# EAGLE schematic Amp_Test_7.2.4 (EAGLE 6.4)
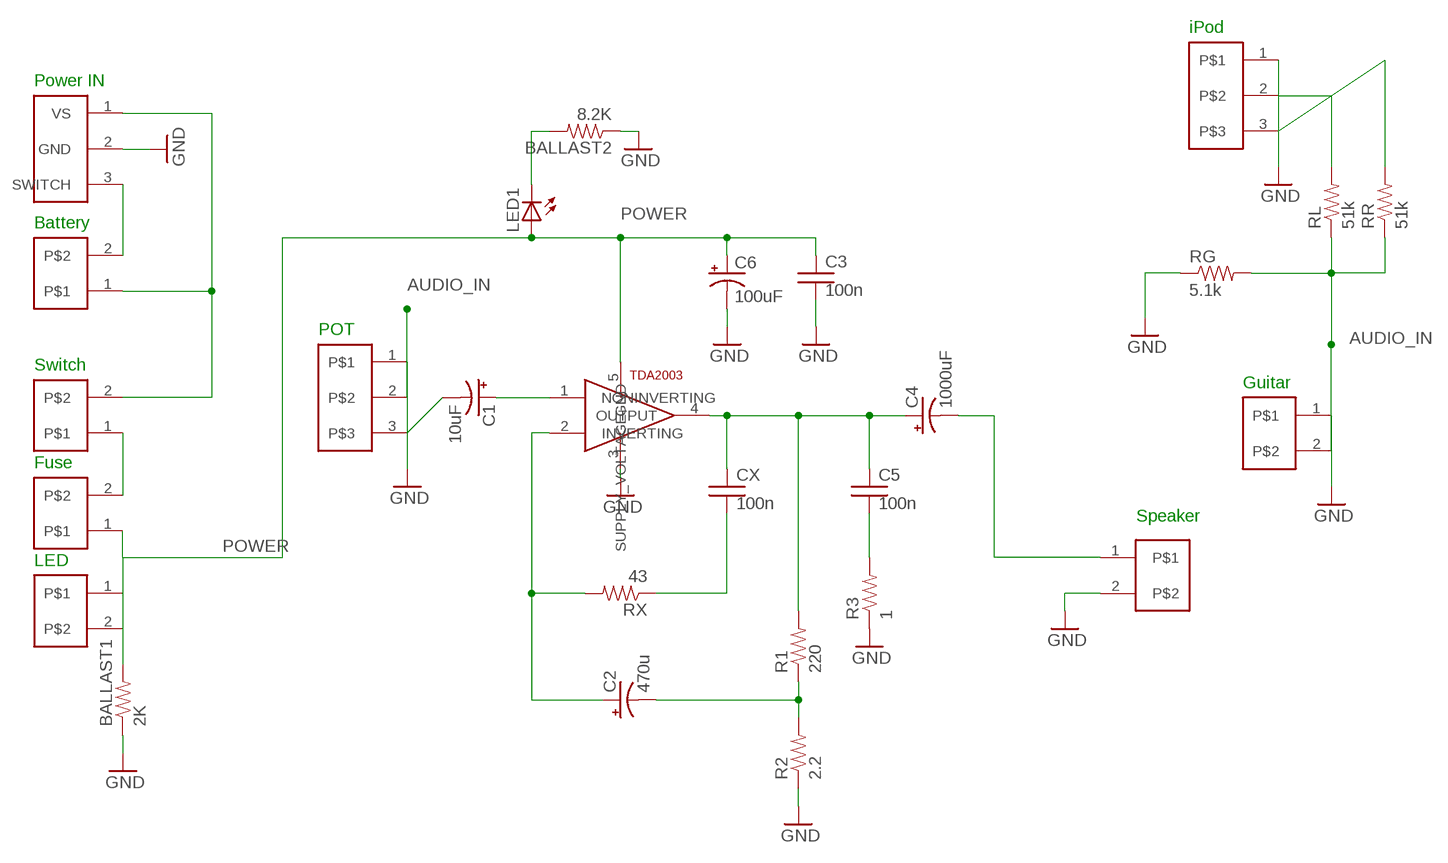
[diagram p0: schematic, sheet 1]

## Parts
BALLAST1  2K  RESISTOR  [RESISTOR_1/4W]
BALLAST2  8.2K  RESISTOR  [RESISTOR_1/4W]
BATTERY  M02  [SCREW_TERMINAL_2_5MM]
C1  10uF  CAP_POL5MMD_5MML  [CAP_POL_5MMD_5MML]
C2  470u  CAP_POLCAP_POL_8MMD_5MMP  [CAP_POL_8MMD_5MMP]
C3  100n  CAP_5MM  [CAP_5MM]
C4  1000uF  CAP_POL10MMD_5MML  [CAP_POL_10MMD_5MMP]
C5  100n  CAP_5MM  [CAP_5MM]
C6  100uF  CAP_POL5MMD_5MML  [CAP_POL_5MMD_5MML]
CX  100n  CAP_5MM  [CAP_5MM]
FUSE  M02  [SCREW_TERMINAL_2_5MM]
GUITAR  M02  [SCREW_TERMINAL_2_5MM]
IPOD  M03  [SCREW_TERMINAL_2_5MM_3]
LED  M02  [SCREW_TERMINAL_2_5MM]
LED1  LED3MM  [LED3MM]
POT  M03  [SCREW_TERMINAL_2_5MM_3]
POWER_IN  DC_POWER_M03  [SCREW_TERMINAL_2_5MM_3]
R1  220  RESISTOR  [RESISTOR_1/4W]
R2  2.2  RESISTOR  [RESISTOR_1/4W]
R3  1  RESISTOR  [RESISTOR_1/4W]
RG  5.1k  RESISTOR  [RESISTOR_1/4W]
RL  51k  RESISTOR  [RESISTOR_1/4W]
RR  51k  RESISTOR  [RESISTOR_1/4W]
RX  43  RESISTOR  [RESISTOR_1/4W]
SPEAKER  M02  [SCREW_TERMINAL_2_5MM]
SWITCH  M02  [SCREW_TERMINAL_2_5MM]
TDA2003  TDA2003APENTAWATT  [PENTAWATT]

## Nets
AUDIO_IN: GUITAR.2 POT.2 RG.P$2 RL.P$1 RR.P$1
GND [GND]: BALLAST1.P$1 BALLAST2.P$1 C3.P$2 C6.- GUITAR.1 IPOD.1 POT.1 POWER_IN.2(GND) R2.P$1 R3.P$1 RG.P$1 SPEAKER.2 TDA2003.3(GND)
N$1: C1.+ TDA2003.1(NONINVERTING)
N$2: BATTERY.2 POWER_IN.3(SWITCH)
N$3 [Signal]: C4.+ C5.P$1 CX.P$1 R1.P$2 TDA2003.4(OUTPUT)
N$4: C2.P$2(-) R1.P$1 R2.P$2
N$5: C5.P$2 R3.P$2
N$6: C2.P$1(+) RX.P$2 TDA2003.2(INVERTING)
N$7: CX.P$2 RX.P$1
N$8: BALLAST1.P$2 LED.1
N$9 [Signal]: C4.- SPEAKER.1
N$10 [POWER]: FUSE.2 SWITCH.1
N$11 [POWER]: BATTERY.1 POWER_IN.1(VS) SWITCH.2
N$12: BALLAST2.P$2 LED1.K(C)
N$13: IPOD.2 RL.P$2
N$14: IPOD.3 RR.P$2
N$15: C1.- POT.3
POWER [POWER]: C3.P$1 C6.+ FUSE.1 LED1.A LED.2 TDA2003.5(SUPPLY_VOLTAGE)

## Notes on the sheet
- iPod
- Power IN
- Battery
- POT
- Switch
- Guitar
- Fuse
- Speaker
- LED

## Library data of the parts
BALLAST1 BALLAST2 R1-R3 RG RL RR RX = ERIC:RESISTOR
BATTERY FUSE GUITAR LED SPEAKER SWITCH = ERIC:M02
C1 C2 C4 C6 = ERIC:CAP_POL: Polarized Capacitor, such as Electrolytic
C3 C5 CX = ERIC:CAP_5MM
IPOD POT = ERIC:M03
LED1 = led:LED: LED OSRAM: - CHIPLED LG R971, LG N971, LY N971, LG Q971, LY Q971, LO R971, LY R971 LH N974, LH R974 LS Q976, LO Q976, LY Q976 LO Q996 - Hyper CHIPLED LW Q18S LB Q993, LB Q99A, LB R99A - SideLED LS A670, LO A670, LY A670, LG A670, LP A670 LB A673, LV A673, LT A673, LW A673 LH A674 LY A675 LS A676, LA A676, LO A676, LY A676, LW A676 LS A679, LY A679, LG A679 - Hyper Micro SIDELED® LS Y876, LA Y876, LO Y876, LY Y876 LT Y87S - SmartLED LW L88C, LW L88S LB L89C, LB L89S, LG L890 LS L89K, LO L89K, LY L89K LS L896, LA L896, LO L896, LY L896 - TOPLED LS T670, LO T670, LY T670, LG T670, LP T670 LSG T670, LSP T670, LSY T670, LOP T670, LYG T670 LG T671, LOG T671, LSG T671 LB T673, LV T673, LT T673, LW T673 LH T674 LS T676, LA T676, LO T676, LY T676, LB T676, LH T676, LSB T676, LW T676 LB T67C, LV T67C, LT T67C, LS T67K, LO T67K, LY T67K, LW E67C LS E67B, LA E67B, LO E67B, LY E67B, LB E67C, LV E67C, LT E67C LW T67C LS T679, LY T679, LG T679 LS T770, LO T770, LY T770, LG T770, LP T770 LB T773, LV T773, LT T773, LW T773 LH T774 LS E675, LA E675, LY E675, LS T675 LS T776, LA T776, LO T776, LY T776, LB T776 LHGB T686 LT T68C, LB T68C - Hyper Mini TOPLED® LB M676 - Mini TOPLED Santana® LG M470 LS M47K, LO M47K, LY M47K Source: http://www.osram.convergy.de LUXEON: - LUMILED® LXK2-PW12-R00, LXK2-PW12-S00, LXK2-PW14-U00, LXK2-PW14-V00 LXK2-PM12-R00, LXK2-PM12-S00, LXK2-PM14-U00 LXK2-PE12-Q00, LXK2-PE12-R00, LXK2-PE12-S00, LXK2-PE14-T00, LXK2-PE14-U00 LXK2-PB12-K00, LXK2-PB12-L00, LXK2-PB12-M00, LXK2-PB14-N00, LXK2-PB14-P00, LXK2-PB14-Q00 LXK2-PR12-L00, LXK2-PR12-M00, LXK2-PR14-Q00, LXK2-PR14-R00 LXK2-PD12-Q00, LXK2-PD12-R00, LXK2-PD12-S00 LXK2-PH12-R00, LXK2-PH12-S00 LXK2-PL12-P00, LXK2-PL12-Q00, LXK2-PL12-R00 Source: www.luxeon.com KINGBRIGHT: KA-3528ASYC Source: www.kingbright.com
POWER_IN = ERIC:DC_POWER_M03
TDA2003 = ERIC:TDA2003A: 10W Car Audio Amplifier in pentawatt package

## Net classes
0 default: width 0.254 mm
1 POWER: width 0.762 mm
2 GND: width 0.254 mm
3 Signal: width 0.635 mm